# Altium schematic sheet CCP_Power_CAN.SchDoc
size A
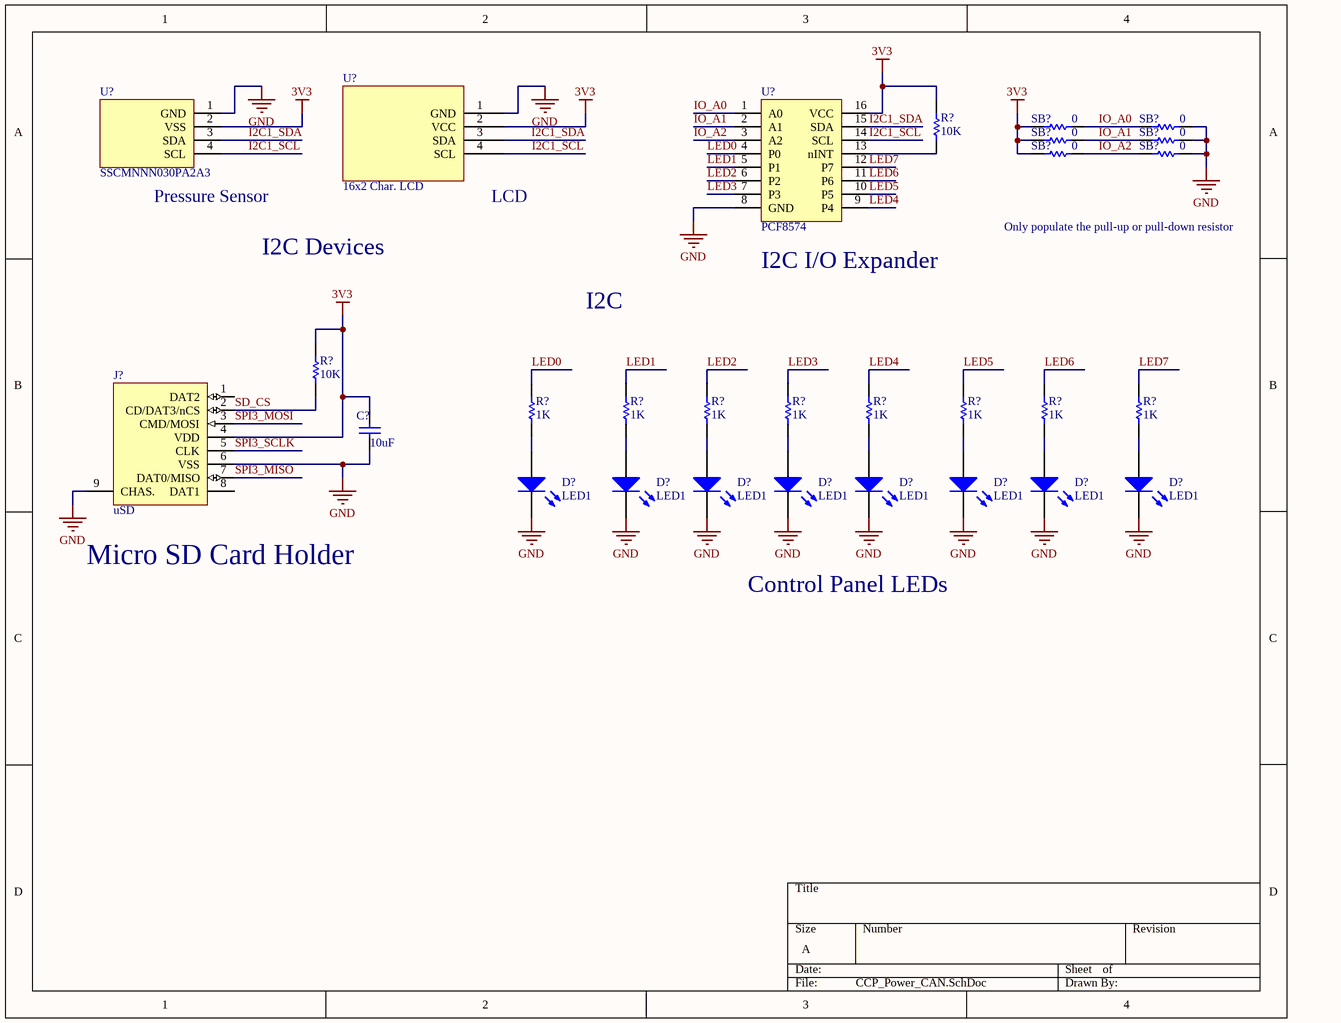
[diagram p0: CCP_Power_CAN.SchDoc]

## Parts
(Parts that share a designator on the sheet are numbered #1, #2 ... from top to bottom, then left to right.)
C?  value 10uF  [C1206]  (hidden comment: Cap)
D?#1  LED1  [1206 LED]
D?#2  LED1  [1206 LED]
D?#3  LED1  [1206 LED]
D?#4  LED1  [1206 LED]
D?#5  LED1  [1206 LED]
D?#6  LED1  [1206 LED]
D?#7  LED1  [1206 LED]
D?#8  LED1  [1206 LED]
J?  uSD  [MICRO_SD_HOLDER]
R?#1  value 10K  [6-0805_M]  (hidden comment: Res1)
R?#2  value 10K  [6-0805_M]  (hidden comment: Res1)
R?#3  value 1K  [1206]  (hidden comment: Res1)
R?#4  value 1K  [1206]  (hidden comment: Res1)
R?#5  value 1K  [1206]  (hidden comment: Res1)
R?#6  value 1K  [1206]  (hidden comment: Res1)
R?#7  value 1K  [1206]  (hidden comment: Res1)
R?#8  value 1K  [1206]  (hidden comment: Res1)
R?#9  value 1K  [1206]  (hidden comment: Res1)
R?#10  value 1K  [1206]  (hidden comment: Res1)
SB?#1  value 0  [6-0805_M]  (hidden comment: Res1)
SB?#2  value 0  [6-0805_M]  (hidden comment: Res1)
SB?#3  value 0  [6-0805_M]  (hidden comment: Res1)
SB?#4  value 0  [6-0805_M]  (hidden comment: Res1)
SB?#5  value 0  [6-0805_M]  (hidden comment: Res1)
SB?#6  value 0  [6-0805_M]  (hidden comment: Res1)
U?#1  SSCMNNN030PA2A3  [8-SMT]
U?#2  16x2 Char. LCD  [B01LC8HZ2O]
U?#3  PCF8574  [16-SOIC]

## Nets
3V3: C?.2 J?.4(VDD) R?#1.2 R?#2.1 SB?#1.2 SB?#3.2 SB?#5.2 U?#1.2(VSS) U?#2.2(VCC) U?#3.16(VCC)
GND: C?.1 D?#1.2(K) D?#2.2(K) D?#3.2(K) D?#4.2(K) D?#5.2(K) D?#6.2(K) D?#7.2(K) D?#8.2(K) J?.6(VSS) J?.9(CHAS.) SB?#2.1 SB?#4.1 SB?#6.1 U?#1.1(GND) U?#2.1(GND) U?#3.8(GND)
I2C1_SCL: U?#1.4(SCL) U?#2.4(SCL) U?#3.14(SCL)
I2C1_SDA: U?#1.3(SDA) U?#2.3(SDA) U?#3.15(SDA)
IO_A0: SB?#1.1 SB?#2.2 U?#3.1(A0)
IO_A1: SB?#3.1 SB?#4.2 U?#3.2(A1)
IO_A2: SB?#5.1 SB?#6.2 U?#3.3(A2)
LED0: R?#3.2 U?#3.4(P0)
LED1: R?#4.2 U?#3.5(P1)
LED2: R?#5.2 U?#3.6(P2)
LED3: R?#6.2 U?#3.7(P3)
LED4: R?#7.2 U?#3.9(P4)
LED5: R?#8.2 U?#3.10(P5)
LED6: R?#9.2 U?#3.11(P6)
LED7: R?#10.2 U?#3.12(P7)
SD_CS: J?.2(CD/DAT3/nCS) R?#2.2
SPI3_MISO: J?.7(DAT0/MISO)
SPI3_MOSI: J?.3(CMD/MOSI)
SPI3_SCLK: J?.5(CLK)
NetD?#1_1: D?#1.1(A) R?#3.1
NetD?#2_1: D?#2.1(A) R?#4.1
NetD?#3_1: D?#3.1(A) R?#5.1
NetD?#4_1: D?#4.1(A) R?#6.1
NetD?#5_1: D?#5.1(A) R?#7.1
NetD?#6_1: D?#6.1(A) R?#8.1
NetD?#7_1: D?#7.1(A) R?#9.1
NetD?#8_1: D?#8.1(A) R?#10.1
NetR?#1_1: R?#1.1 U?#3.13(nINT)

Not connected (* = marked no-connect by the designer): J? 1(DAT2) 8(DAT1)

## Notes on the sheet
- (near U?#1) Pressure Sensor
- (near U?#2) LCD
- Only populate the pull-up or pull-down resistor
- I2C Devices
- (near U?#3) I2C I/O Expander
- I2C
- (near J?) Micro SD Card Holder
- Control Panel LEDs

## Library data of the parts
C? = Cap: Capacitor; Published: 8-Jun-2000; LatestRevisionDate: 17-Jul-2002; LatestRevisionNote: Re-released for DXP Platform.; PackageReference: RAD-0.3; Publisher: Altium Limited; PackageDescription: Radial Cap, Thru-Hole; 2 Leads; 0.3 in Pin Spacing
D?#1-D?#8 = LED1: Typical RED GaAs LED; Published: 8-Jun-2000; LatestRevisionDate: 08-Jul-2005; LatestRevisionNote: Mech Layer 1 removed.; PackageReference: LED-1; Publisher: Altium Limited; PackageDescription: LED; 2 Leads
J? = SD Card
R?#1-R?#10 SB?#1-SB?#6 = Res1: Resistor; Published: 8-Jun-2000; LatestRevisionDate: 17-Jul-2002; LatestRevisionNote: Re-released for DXP Platform.; PackageReference: AXIAL-0.3; Publisher: Altium Limited; PackageDescription: Axial Device, Thru-Hole; 2 Leads; 0.3 in Pin Spacing
U?#1 = SSCMNNN030PA2A3: Honeywell Digital Pressure Sensor; ComponentLink1Description: Part; ComponentLink1URL: https://www.digikey.com/product-detail/en/honeywell-sensing-and-productivity-solutions/SSCMNNN030PA2A3/480-6407-ND/2416123; ComponentLink2Description: Datasheet; ComponentLink2URL: https://sensing.honeywell.com/index.php?ci_id=151134
U?#2 = B01LC8HZ2O: LCD 16x2 Character; ComponentLink1Description: Part; ComponentLink1URL: https://www.amazon.in/Industry-Interface-Display-Character-MEGA2560/dp/B01LC8HZ2O
U?#3 = PCF8574: I2C I/O Expander; ComponentLink1Description: Part; ComponentLink1URL: https://www.digikey.com/product-detail/en/texas-instruments/PCF8574DWR/296-13108-1-ND/484579; ComponentLink2Description: Datasheet; ComponentLink2URL: http://www.ti.com/lit/ds/symlink/pcf8574.pdf